# EAGLE design 2m_70cm_diplexer (EAGLE 7.6.0)
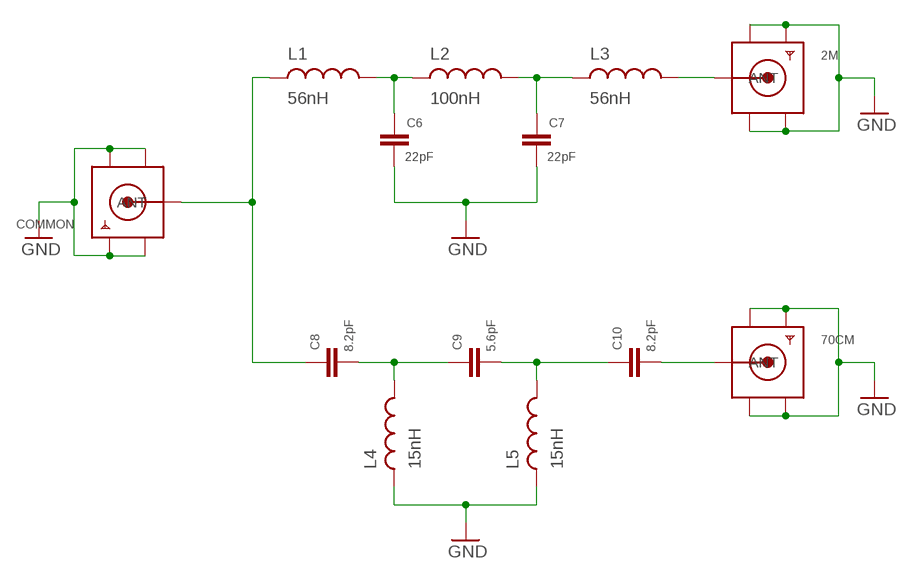
[diagram p0: schematic, sheet 1]

## Parts
2M  SMACONNECTOR_EDGE  [SMA_EDGELAUNCH]
70CM  SMACONNECTOR_EDGE  [SMA_EDGELAUNCH]
C6  22pF  0805CAP  [0805]
C7  22pF  0805CAP  [0805]
C8  8.2pF  0805CAP  [0805]
C9  5.6pF  0805CAP  [0805]
C10  8.2pF  0805CAP  [0805]
COMMON  SMACONNECTOR_EDGE  [SMA_EDGELAUNCH]
L1  56nH  1008INDUCTOR  [1008INDUCTOR]
L2  100nH  1008INDUCTOR  [1008INDUCTOR]
L3  56nH  1008INDUCTOR  [1008INDUCTOR]
L4  15nH  1008INDUCTOR  [1008INDUCTOR]
L5  15nH  1008INDUCTOR  [1008INDUCTOR]

## Nets
GND: 2M.GND@1(GND4) 2M.GND@2(GND3) 2M.GND@3(GND2) 2M.GND@4(GND1) 70CM.GND@1(GND4) 70CM.GND@2(GND3) 70CM.GND@3(GND2) 70CM.GND@4(GND1) C6.P$1 C7.P$1 COMMON.GND@1(GND4) COMMON.GND@2(GND3) COMMON.GND@3(GND2) COMMON.GND@4(GND1) L4.P$1 L5.P$1
L2 [RF]: C7.P$2 L2.P$2 L3.P$1
N$1 [RF]: 2M.P(ANT) L3.P$2
N$3 [RF]: C6.P$2 L1.P$2 L2.P$1
N$4 [RF]: C8.P$1 C9.P$2 L4.P$2
N$5 [RF]: C9.P$1 C10.P$2 L5.P$2
N$6 [RF]: 70CM.P(ANT) C10.P$1
N$15 [RF]: C8.P$2 COMMON.P(ANT) L1.P$1

## Library data of the parts
2M 70CM COMMON = adafruit:SMACONNECTOR: SMA Connector 90° DIP SMA Connector, 50 Ohm (4UConnector: 07259)
C6-C10 = Samsung-Passives:0805CAP
L1-L5 = FerroCore:1008INDUCTOR

## Net classes
1 RF: width 1.016 mm, clearance 0.508 mm

## Board
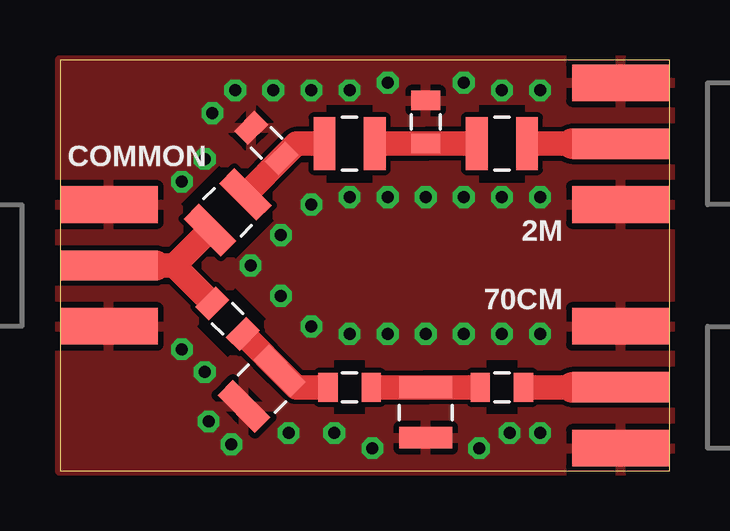
[diagram p1: board, top side]
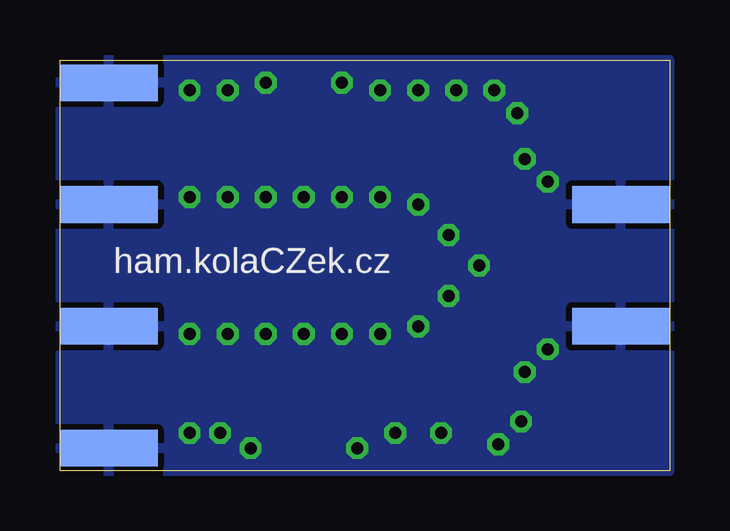
[diagram p2: board, bottom side, seen from below]

Size 25.4 x 17.14 mm. Coordinates in mm from the lower left corner, seen from the top.
Outline: 0,0 25.4,0 25.4,17.14 0,17.14 0,0
Copper layers (1*16): Top 0.035mm / dielectric 1.5mm / Bottom 0.035mm
Design rules "default *": minimum track width 10mil, minimum drill 24mil, track to track 8mil, track to pad 8mil, pad to pad 8mil, via to via 8mil, smd to smd 8mil, copper to edge 0mil, drill to drill 8mil, minimum pad ring 10mil, minimum via ring 8mil, stop-mask expansion 4mil, vias tented up to drill 100mil, thermal gap 10mil

### Footprints (pad centres in the part's own frame; a part is rotated, then mirrored left to right if it is on the bottom)
SMA_EDGELAUNCH = smd 4.064 x 1.524: GND@1 2.032,-2.54; GND@2 2.032,2.54 | smd 4.064 x 1.524 bottom: GND@3 2.032,2.54; GND@4 2.032,-2.54 | smd 4.064 x 1.27: P 2.032,0
0805 = smd 0.8 x 1.2: P$1 -0.9,0; P$2 0.9,0
1008INDUCTOR = smd 0.9 x 2.2: P$1 -1.05,0; P$2 1.05,0

### Placement (x,y rotation side)
2M  25.4,13.65 180 top
70CM  25.4,3.49 180 top
C6  8.6,13.68 315 top
C7  15.24,14.55 270 top
C8  6.99,6.35 135 top
C9  12.06,3.49 180 top
C10  18.41,3.49 180 top
COMMON  0,8.57 0 top
L1  6.99,10.79 45 top
L2  12.06,13.65 0 top
L3  18.41,13.65 0 top
L4  8.41,3.44 45 top
L5  15.24,2.44 90 top

### Tracks (layer width: path | path; a pad name or v marks a point on that pad's centre or on a via)
GND  (via drill 0.5)
  other vias: 7.94,8.57 6.03,13.02 5.08,12.06 5.08,5.08 6.03,4.13 9.21,7.3 10.48,6.03 12.06,5.71 13.65,5.71 15.24,5.71 16.83,5.71 18.41,5.71 20,5.71 9.21,9.84 10.48,11.11 12.06,11.43 13.65,11.43 15.24,11.43 16.83,11.43 18.41,11.43 20,11.43 6.35,14.92 7.3,15.88 8.89,15.88 10.48,15.88 12.06,15.88 13.65,16.19 16.83,16.19 18.41,15.88 20,15.88 6.19,2.06 7.14,1.11 9.53,1.59 11.43,1.59 13.02,0.95 17.46,0.95 20,1.59 18.73,1.59
  pour Top: 0,17.14 25.4,17.14 25.4,0 0,0
  pour Bottom: 0,17.14 25.4,17.14 25.4,0 0,0
L2
  Top 0.254: L2.P$2 13.34,13.65 | L3.P$1 17.14,13.65
  Top 1.016: 13.34,13.65 C7.P$2 17.14,13.65
N$1
  Top 0.254: L3.P$2 20,13.65
  Top 1.016: 19.68,13.65 20,13.65 21.34,13.65
  Top 1.27: 2M.P 21.34,13.65
N$2
  cutout Top: 11.11,15.26 13.02,15.26 13.02,12.04 11.11,12.04
  cutout Top: 17.46,15.26 19.37,15.26 19.37,12.04 17.46,12.04
N$3
  Top 0.254: L1.P$2 7.94,11.75 | L2.P$1 10.79,13.65
  Top 1.016: 7.94,11.75 C6.P$2 9.85,13.65 10.79,13.65
N$4
  Top 0.254: C8.P$1 7.94,5.4 | C9.P$2 10.79,3.49
  Top 1.016: 7.94,5.4 L4.P$2 9.84,3.49 10.79,3.49
N$5
  Top 0.254: C10.P$2 17.14,3.49 | C9.P$1 13.34,3.49
  Top 1.016: 17.14,3.49 L5.P$2 | 13.34,3.49 L5.P$2 | L5.P$2
N$6
  Top 0.254: C10.P$1 19.68,3.49
  Top 1.016: 19.68,3.49 21.34,3.49
  Top 1.27: 70CM.P 21.34,3.49
N$7
  cutout Top: 11.43,4.61 12.7,4.61 12.7,2.39 11.43,2.39
  cutout Top: 17.78,4.61 19.05,4.61 19.05,2.39 17.78,2.39
N$8
  cutout Top: 7.3,7.62 8.57,6.35 6.99,4.76 5.71,6.03
N$9
  cutout Top: 5.04,11.13 6.64,12.73 8.92,10.45 7.33,8.86
N$15
  Top 0.254: 6.03,7.3 C8.P$2 | 5.87,10.05 5.87,9.68 L1.P$1
  Top 1.016: 3.96,8.57 4.76,8.57 | 4.76,8.57 | 6.03,9.84 5.87,9.68 4.76,8.57 | 6.03,7.3 4.76,8.57
  Top 1.27: COMMON.P 3.96,8.57

### Text on the board
bNames: ham.kolaCZek.cz